# EAGLE design led_logger_v3 (EAGLE 6.5.0)
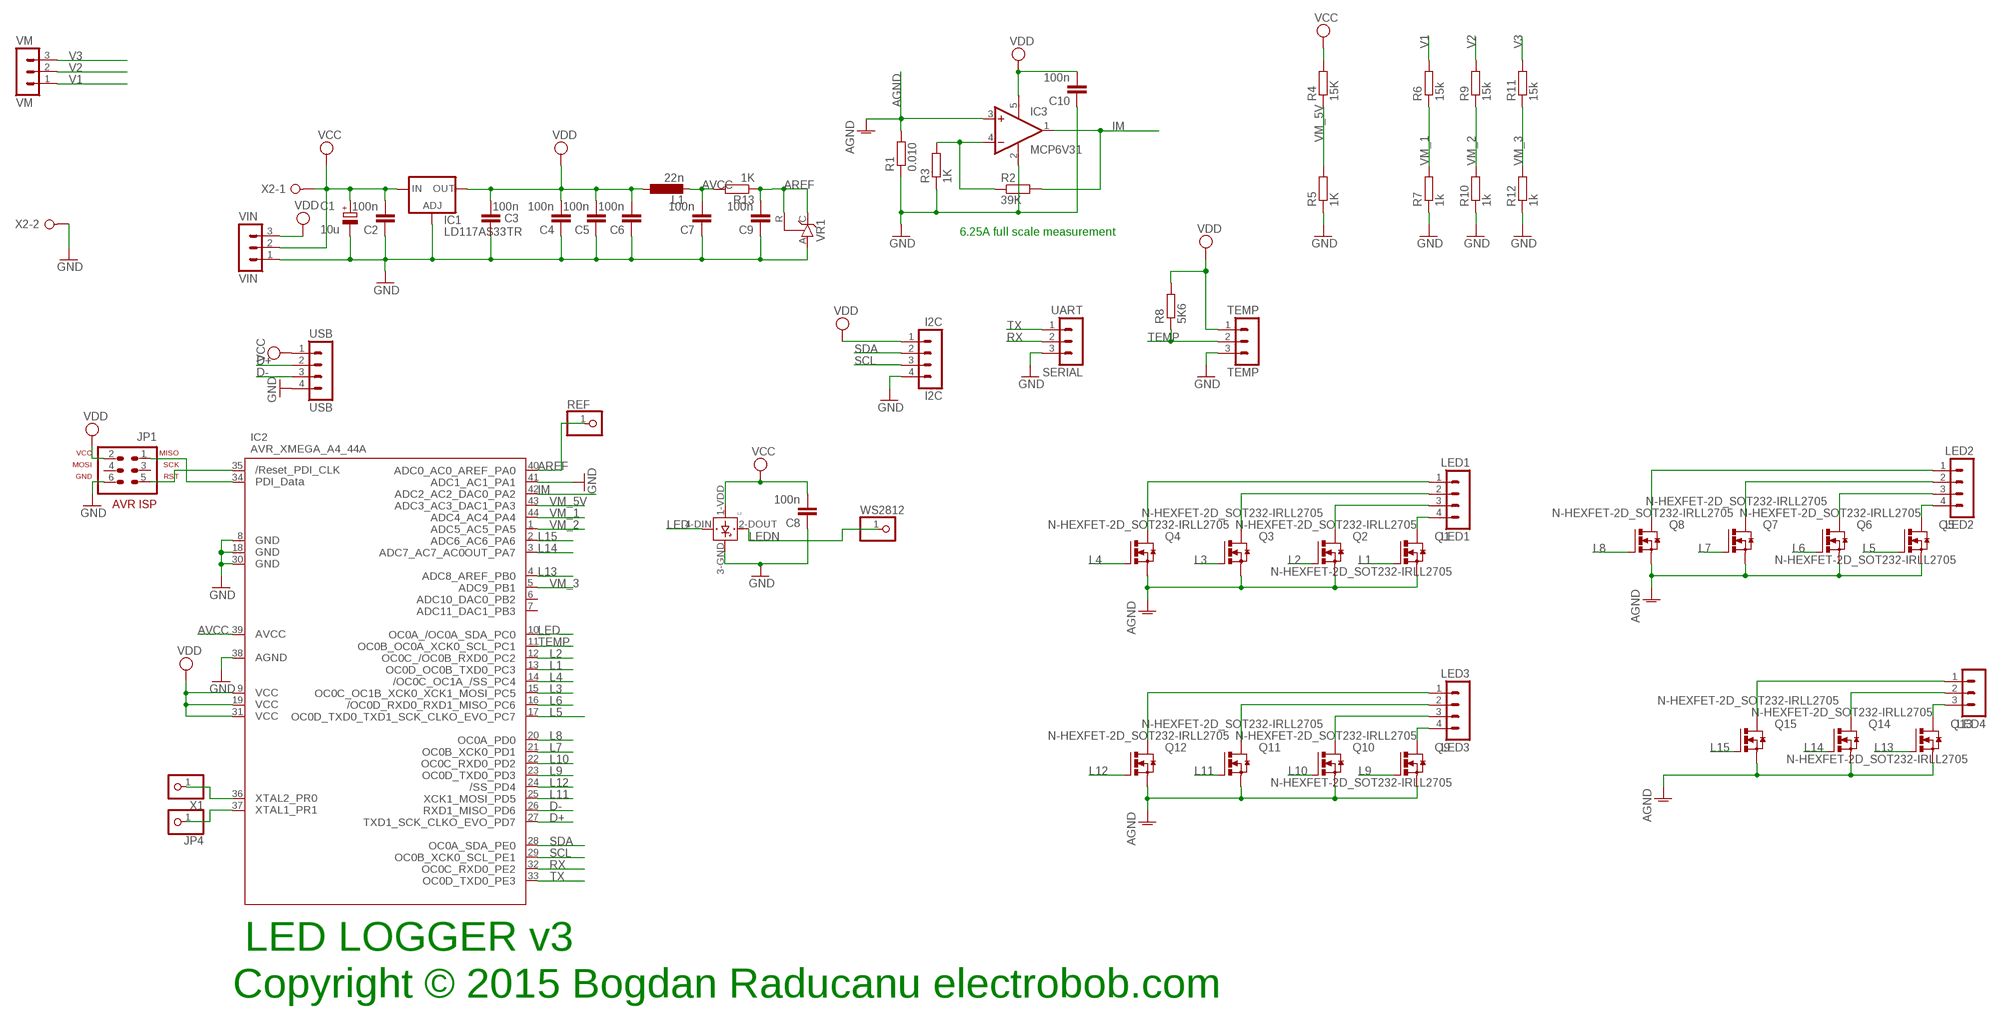
[diagram p0: schematic, sheet 1]

## Parts
C1  10u  CPOL-EUSMCA  [SMC_A]
C2  100n  C-EUC0805  [C0805]
C3  100n  C-EUC0805  [C0805]
C4  100n  C-EUC0805  [C0805]
C5  100n  C-EUC0805  [C0805]
C6  100n  C-EUC0805  [C0805]
C7  100n  C-EUC0805  [C0805]
C8  100n  C-EUC0805  [C0805]
C9  100n  C-EUC1206  [C1206]
C10  100n  C-EUC0805  [C0805]
I2C  I2C  MA04-1  [MA04-1]
IC1  LD117AS33TR  [SOT223]
IC2  AVR_XMEGA_A4_44A  [TQFP44]
IC3  MCP6V31  MCP601OT  [SOT23-5]
JP1  AVR-ISP-6VERT  [AVR-ISP-6]
JP4  PINHD-1X1  [1X01]
L1  22n  L-EUL2012C  [L2012C]
L2  WS2812B  [WS2812B]
LED1  LED1  MA04-1  [MA04-1]
LED2  LED2  MA04-1  [MA04-1]
LED3  LED3  MA04-1  [MA04-1]
LED4  MA03-1  [MA03-1]
Q1  N-HEXFET-2D_SOT232-IRLL2705  [SOT223]
Q2  N-HEXFET-2D_SOT232-IRLL2705  [SOT223]
Q3  N-HEXFET-2D_SOT232-IRLL2705  [SOT223]
Q4  N-HEXFET-2D_SOT232-IRLL2705  [SOT223]
Q5  N-HEXFET-2D_SOT232-IRLL2705  [SOT223]
Q6  N-HEXFET-2D_SOT232-IRLL2705  [SOT223]
Q7  N-HEXFET-2D_SOT232-IRLL2705  [SOT223]
Q8  N-HEXFET-2D_SOT232-IRLL2705  [SOT223]
Q9  N-HEXFET-2D_SOT232-IRLL2705  [SOT223]
Q10  N-HEXFET-2D_SOT232-IRLL2705  [SOT223]
Q11  N-HEXFET-2D_SOT232-IRLL2705  [SOT223]
Q12  N-HEXFET-2D_SOT232-IRLL2705  [SOT223]
Q13  N-HEXFET-2D_SOT232-IRLL2705  [SOT223]
Q14  N-HEXFET-2D_SOT232-IRLL2705  [SOT223]
Q15  N-HEXFET-2D_SOT232-IRLL2705  [SOT223]
R1  0.010  R-EU_0414/5V  [0414V]
R2  39K  R-EU_R0805  [R0805]
R3  1K  R-EU_R0805  [R0805]
R4  15K  R-EU_R0805  [R0805]
R5  1K  R-EU_R0805  [R0805]
R6  15k  R-EU_R0805  [R0805]
R7  1k  R-EU_R0805  [R0805]
R8  5K6  R-EU_R0805  [R0805]
R9  15k  R-EU_R0805  [R0805]
R10  1k  R-EU_R0805  [R0805]
R11  15k  R-EU_R0805  [R0805]
R12  1k  R-EU_R0805  [R0805]
R13  1K  R-EU_R0805  [R0805]
REF  PINHD-1X1  [1X01]
SERIAL  UART  MA03-1  [MA03-1]
TEMP  TEMP  MA03-1  [MA03-1]
USB  USB  MA04-1  [MA04-1]
VIN  VIN  MA03-1  [MA03-1]
VM  VM  MA03-1  [MA03-1]
VR1  TL431CLP  [TO92-CLP]
WS2812  PINHD-1X1  [1X01]
X1  PINHD-1X1  [1X01]
X2  W237-02P  [W237-132]

## Nets
AGND: IC3.3(+IN) Q1.3(S) Q2.3(S) Q3.3(S) Q4.3(S) Q5.3(S) Q6.3(S) Q7.3(S) Q8.3(S) Q9.3(S) Q10.3(S) Q11.3(S) Q12.3(S) Q13.3(S) Q14.3(S) Q15.3(S) R1.2
AREF: C9.2 IC2.40(PA0) R13.1 REF.1 VR1.C VR1.R
AVCC: C7.2 IC2.39(AVCC) L1.2 R13.2
D+: IC2.27(PD7) USB.2
D-: IC2.26(PD6) USB.3
GND: C1.- C2.1 C3.1 C4.1 C5.1 C6.1 C7.1 C8.1 C9.1 C10.1 I2C.4 IC1.1(ADJ) IC2.8(GND1) IC2.18(GND2) IC2.30(GND3) IC2.38(AGND) IC2.41(PA1) IC3.2(V-) JP1.6 L2.3-GND(GND) R1.1 R3.1 R5.1 R7.1 R10.1 R12.1 SERIAL.3 TEMP.3 USB.4 VIN.1 VR1.A X2.2
IM: IC2.42(PA2) IC3.1(OUT) R2.2
L1: IC2.13(PC3) Q1.1(G)
L2: IC2.12(PC2) Q2.1(G)
L3: IC2.15(PC5) Q3.1(G)
L4: IC2.14(PC4) Q4.1(G)
L5: IC2.17(PC7) Q5.1(G)
L6: IC2.16(PC6) Q6.1(G)
L7: IC2.21(PD1) Q7.1(G)
L8: IC2.20(PD0) Q8.1(G)
L9: IC2.23(PD3) Q9.1(G)
L10: IC2.22(PD2) Q10.1(G)
L11: IC2.25(PD5) Q11.1(G)
L12: IC2.24(PD4) Q12.1(G)
L13: IC2.4(PB0) Q13.1(G)
L14: IC2.3(PA7) Q14.1(G)
L15: IC2.2(PA6) Q15.1(G)
LED: IC2.10(PC0) L2.4-DIN(DIN)
LEDN: L2.2-DOUT(DOUT) WS2812.1
N$1: LED2.4 Q5.2(D) Q5.4(D)
N$2: LED3.3 Q10.2(D) Q10.4(D)
N$3: LED2.2 Q7.2(D) Q7.4(D)
N$4: LED2.1 Q8.2(D) Q8.4(D)
N$5: LED3.4 Q9.2(D) Q9.4(D)
N$6: LED1.4 Q1.2(D) Q1.4(D)
N$7: LED1.3 Q2.2(D) Q2.4(D)
N$8: LED1.2 Q3.2(D) Q3.4(D)
N$9: LED1.1 Q4.2(D) Q4.4(D)
N$10: LED2.3 Q6.2(D) Q6.4(D)
N$11: IC2.35(RESET) JP1.5
N$12: LED3.2 Q11.2(D) Q11.4(D)
N$13: LED3.1 Q12.2(D) Q12.4(D)
N$14: IC3.4(-IN) R2.1 R3.2
N$15: IC2.36(PR0) X1.1
N$17: IC2.37(PR1) JP4.1
N$18: LED4.3 Q13.2(D) Q13.4(D)
N$19: IC2.34(PDI_DATA) JP1.1
N$20: LED4.1 Q15.2(D) Q15.4(D)
N$22: LED4.2 Q14.2(D) Q14.4(D)
RX: IC2.32(PE2) SERIAL.2
SCL: I2C.3 IC2.29(PE1)
SDA: I2C.2 IC2.28(PE0)
TEMP: IC2.11(PC1) R8.1 TEMP.2
TX: IC2.33(PE3) SERIAL.1
V1: R6.2 VM.1
V2: R9.2 VM.2
V3: R11.2 VM.3
VCC: C1.+ C2.2 C8.2 IC1.3(IN) L2.1-VDD(VDD) R4.2 USB.1 VIN.2 X2.1
VDD: C3.2 C4.2 C5.2 C6.2 C10.2 I2C.1 IC1.4(OUT) IC2.9(VCC1) IC2.19(VCC2) IC2.31(VCC3) IC3.5(V+) JP1.2 L1.1 R8.2 TEMP.1 VIN.3
VM_1: IC2.44(PA4) R6.1 R7.2
VM_2: IC2.1(PA5) R9.1 R10.2
VM_3: IC2.5(PB1) R11.1 R12.2
VM_5V: IC2.43(PA3) R4.1 R5.2
Unconnected: IC2.6(PB2) IC2.7(PB3) JP1.3 JP1.4

## Notes on the sheet
- 6.25A full scale measurement
- LED LOGGER v3
- Copyright © 2015 Bogdan Raducanu electrobob.com

## Library data of the parts
C1 = rcl:CPOL-EU: POLARIZED CAPACITOR, European symbol
C2-C10 = rcl:C-EU: CAPACITOR, European symbol
I2C LED1-LED3 USB = con-lstb:MA04-1: PIN HEADER; OC_FARNELL: unknown; OC_NEWARK: unknown
IC1 = v-reg:LD117A?*: Low drop fixed and adjustable positive voltage regulators 1 A Source: http://www.st.com/stonline/products/literature/ds/7194/ld1117axx.pdf
IC2 = xmega:AVR_XMEGA_A4_: Device for Atmel AVR XMEGA A4 Series
IC3 = linear:MCP601: Single Op Amp 2.7V to 6.0V Single Supply CMOS Source: http://ww1.microchip.com/downloads/en/DeviceDoc/21314g.pdf
JP1 = avr-7:AVR-ISP-6: AVR ISP-6 Serial Programming Header
JP4 REF WS2812 X1 = pinhead:PINHD-1X1: PIN HEADER
L1 = resistor:L-EU: INDUCTOR, European symbol
L2 = adafruit:WS2812B
LED4 SERIAL TEMP VIN VM = con-lstb:MA03-1: PIN HEADER; OC_FARNELL: unknown; OC_NEWARK: unknown
Q1-Q15 = transistor-power:N-HEXFET-2D_?-*: HEXFET® Power MOSFET 2 Drain connects http://www.irf.com/product-info/datasheets/data/irll014n.pdf
R1-R13 = rcl:R-EU_: RESISTOR, European symbol
VR1 = v-reg:TL431CLP: VOLTAGE REGULATOR
X2 = con-wago-508:W237-02P: WAGO SREW CLAMP; OC_FARNELL: unknown; OC_NEWARK: unknown

## Board
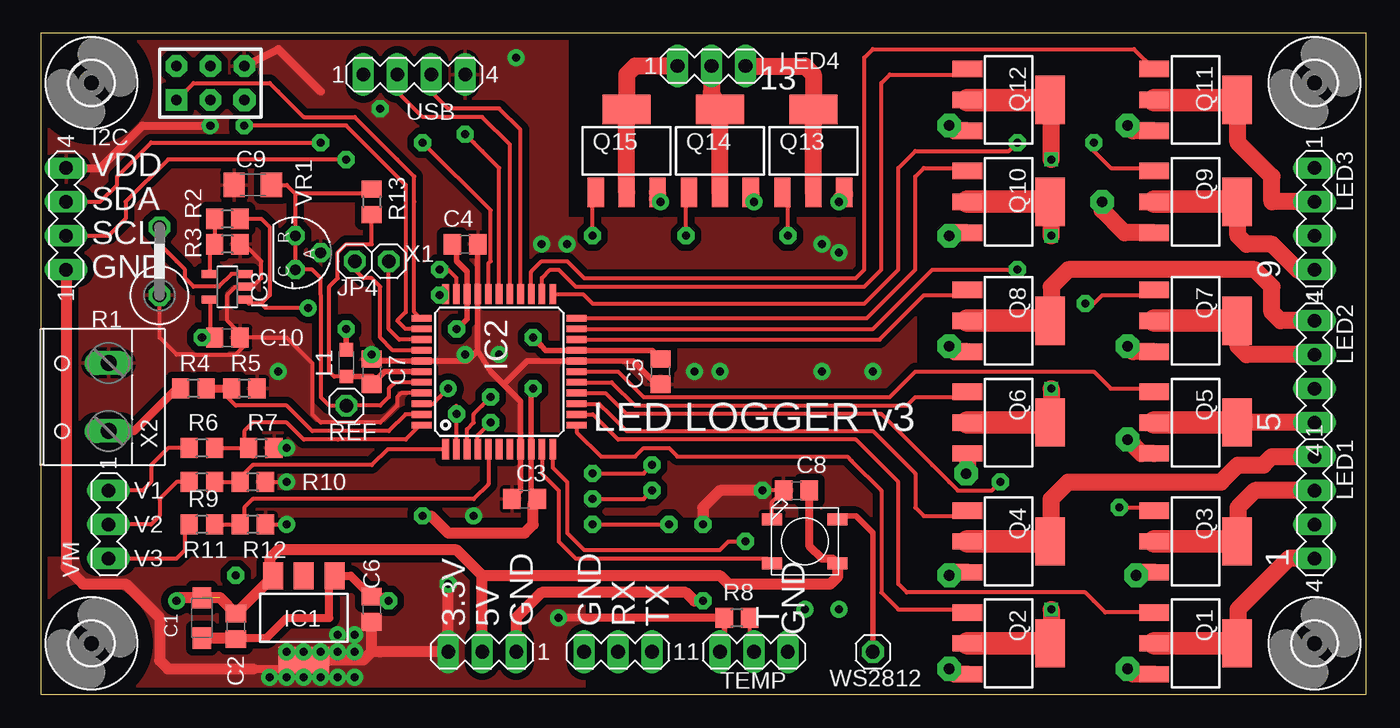
[diagram p1: board, top side]
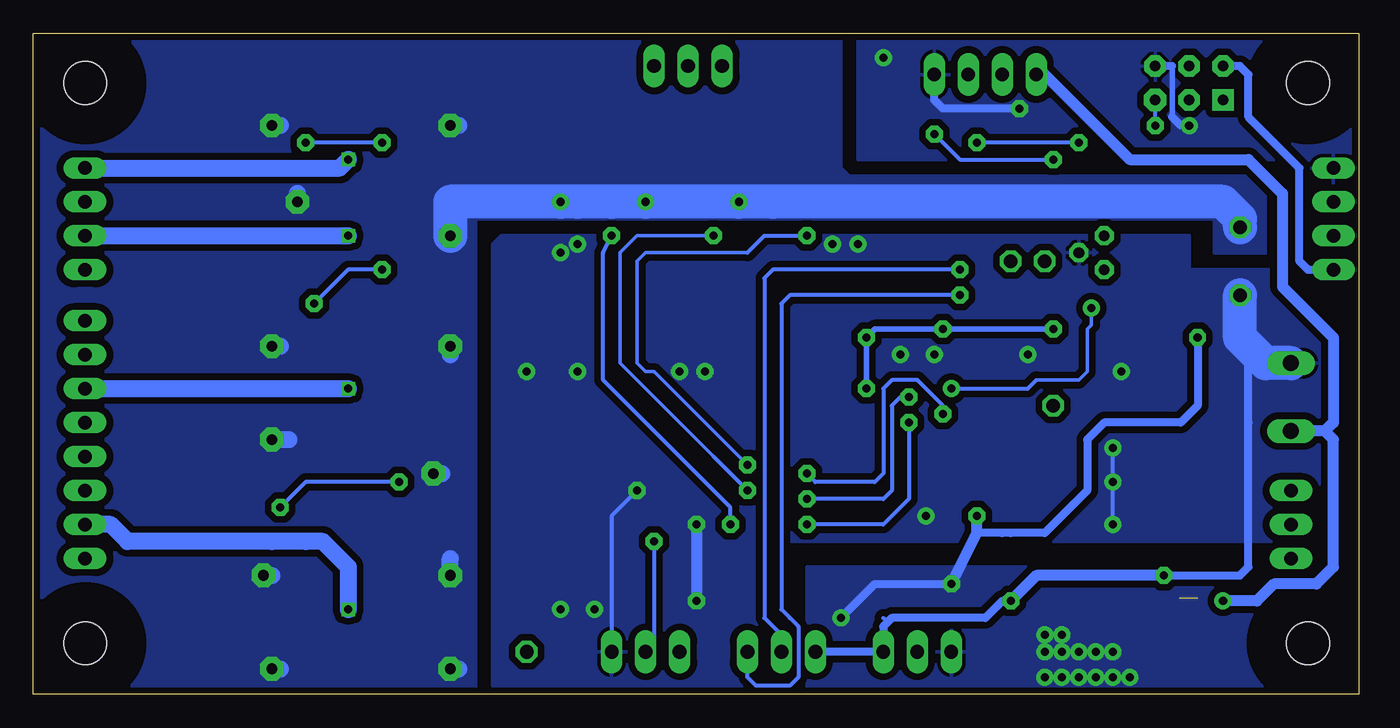
[diagram p2: board, bottom side, seen from below]

Size 99.11 x 49.42 mm. Coordinates in mm from the lower left corner, seen from the top.
Outline: 0,0 99.11,0 99.11,49.42 0,49.42 0,0
Copper layers (1*16): Top 0.035mm / dielectric 1.5mm / Bottom 0.035mm
Design rules "DFRobot_Eagle_Rule_v0.4": minimum track width 6mil, minimum drill 12mil, track to track 6mil, track to pad 6mil, pad to pad 6mil, via to via 6mil, smd to smd 0mil, copper to edge 10mil, drill to drill 10mil, minimum pad ring 12mil, minimum via ring 8mil, stop-mask expansion 2mil, vias tented up to drill 25mil, thermal gap 10mil

### Footprints (pad centres in the part's own frame; a part is rotated, then mirrored left to right if it is on the bottom)
SMC_A = smd 1.6 x 1.4: + -1.5,0; - 1.5,0
C0805 = smd 1.3 x 1.5: 1 -0.95,0; 2 0.95,0
C1206 = smd 1.6 x 1.8: 1 -1.4,0; 2 1.4,0
MA04-1 = drill 1.016 long: 1 -3.81,0; 2 -1.27,0; 3 1.27,0; 4 3.81,0
SOT223 = smd 1.5 x 2: 1 -2.3,-3.15; 2 0,-3.15; 3 2.3,-3.15 | smd 3.8 x 2: 4 0,3.15
TQFP44 = smd 1.5 x 0.5: 1 -5.8,4; 2 -5.8,3.2; 3 -5.8,2.4; 4 -5.8,1.6; 5 -5.8,0.8; 6 -5.8,0; 7 -5.8,-0.8; 8 -5.8,-1.6; 9 -5.8,-2.4; 10 -5.8,-3.2; 11 -5.8,-4; 23 5.8,-4; 24 5.8,-3.2; 25 5.8,-2.4; 26 5.8,-1.6; 27 5.8,-0.8; 28 5.8,0; 29 5.8,0.8; 30 5.8,1.6; 31 5.8,2.4; 32 5.8,3.2; 33 5.8,4 | smd 0.5 x 1.5: 12 -4,-5.8; 13 -3.2,-5.8; 14 -2.4,-5.8; 15 -1.6,-5.8; 16 -0.8,-5.8; 17 0,-5.8; 18 0.8,-5.8; 19 1.6,-5.8; 20 2.4,-5.8; 21 3.2,-5.8; 22 4,-5.8; 34 4,5.8; 35 3.2,5.8; 36 2.4,5.8; 37 1.6,5.8; 38 0.8,5.8; 39 0,5.8; 40 -0.8,5.8; 41 -1.6,5.8; 42 -2.4,5.8; 43 -3.2,5.8; 44 -4,5.8
SOT23-5 = smd 0.6 x 1.2: 1 -0.95,-1.306; 2 0,-1.306; 3 0.95,-1.306; 4 0.95,1.306; 5 -0.95,1.306
AVR-ISP-6 = drill 0.8 pad 1.6 square: 1 -2.54,-1.27 | drill 0.8 pad 1.6 octagon: 2 -2.54,1.27; 3 0,-1.27; 4 0,1.27; 6 2.54,1.27 | drill 0.8 pad 1.67 octagon: 5 2.54,-1.27
1X01 = drill 1.016 octagon: 1 0,0
L2012C = smd 1 x 1: 1 -1,0; 2 1,0
WS2812B = smd 1.5 x 0.9: 1-VDD 2.45,-1.65; 2-DOUT 2.45,1.65; 3-GND -2.45,1.65; 4-DIN -2.45,-1.65
MA03-1 = drill 1.016 long: 1 -2.54,0; 2 0,0; 3 2.54,0
SOT223' = smd 1.219 x 2.235: 1 -2.311,-3.099; 2 0,-3.099; 3 2.311,-3.099 | smd 3.6 x 2.2: 4 0,3.099
0414V = drill 1.016 octagon: 1 -2.54,0; 2 2.54,0
R0805 = smd 1.3 x 1.5: 1 -0.95,0; 2 0.95,0
3,2 = hole 3.2: 0,0
TO92-CLP = drill 0.813 octagon: A 0,1.905; C 1.27,0; R -1.27,0
W237-132 = drill 1.194 long: 1 -2.54,-0.635; 2 2.54,-0.635

### Placement (x,y rotation side)
C1  12.06,5.71 270 top
C2  14.61,5.08 90 top
C3  36.2,14.61 0 top
C4  31.75,33.66 180 top
C5  46.35,24.13 90 top
C6  24.77,6.35 270 top
C7  24.77,24.13 270 top
C8  56.52,15.24 0 top
C9  15.88,38.1 0 top
C10  13.97,26.67 180 top
I2C  1.91,35.56 90 top
IC1  19.68,5.71 180 top
IC2  34.29,24.13 90 top
IC3  13.97,30.48 90 top
JP1  12.7,45.72 0 top
JP4  23.5,32.38 0 top
L1  22.86,24.77 270 top
L2  57.15,11.43 0 top
LED1  95.25,13.97 270 top
LED2  95.25,24.13 270 top
LED3  95.25,35.56 270 top
LED4  50.16,46.99 0 top
Q1  N-HEXFET-2D_SOT232-IRLL2705  [SOT223']  86.36,3.81 270 top
Q2  N-HEXFET-2D_SOT232-IRLL2705  [SOT223']  72.39,3.81 270 top
Q3  N-HEXFET-2D_SOT232-IRLL2705  [SOT223']  86.36,11.43 270 top
Q4  N-HEXFET-2D_SOT232-IRLL2705  [SOT223']  72.39,11.43 270 top
Q5  N-HEXFET-2D_SOT232-IRLL2705  [SOT223']  86.36,20.32 270 top
Q6  N-HEXFET-2D_SOT232-IRLL2705  [SOT223']  72.39,20.32 270 top
Q7  N-HEXFET-2D_SOT232-IRLL2705  [SOT223']  86.36,27.94 270 top
Q8  N-HEXFET-2D_SOT232-IRLL2705  [SOT223']  72.39,27.94 270 top
Q9  N-HEXFET-2D_SOT232-IRLL2705  [SOT223']  86.36,36.83 270 top
Q10  N-HEXFET-2D_SOT232-IRLL2705  [SOT223']  72.39,36.83 270 top
Q11  N-HEXFET-2D_SOT232-IRLL2705  [SOT223']  86.36,44.45 270 top
Q12  N-HEXFET-2D_SOT232-IRLL2705  [SOT223']  72.39,44.45 270 top
Q13  N-HEXFET-2D_SOT232-IRLL2705  [SOT223']  57.78,40.64 0 top
Q14  N-HEXFET-2D_SOT232-IRLL2705  [SOT223']  50.8,40.64 0 top
Q15  N-HEXFET-2D_SOT232-IRLL2705  [SOT223']  43.81,40.64 0 top
R1  8.89,32.38 90 top
R2  13.97,35.56 0 top
R3  13.97,33.66 180 top
R4  11.43,22.86 180 top
R5  15.24,22.86 180 top
R6  12.06,18.41 180 top
R7  16.51,18.41 180 top
R8  52.07,5.71 180 top
R9  12.06,15.88 180 top
R10  15.88,15.88 180 top
R11  12.06,12.7 180 top
R12  15.88,12.7 180 top
R13  24.77,36.83 270 top
REF  22.86,21.59 0 top
SERIAL  43.18,3.17 180 top
TEMP  53.34,3.17 0 top
U$1  [3,2]  3.81,3.81 0 top
U$2  [3,2]  3.81,45.72 0 top
U$3  [3,2]  95.25,45.72 0 top
U$4  [3,2]  95.25,3.81 0 top
USB  27.94,46.35 0 top
VIN  33.02,3.17 180 top
VM  5.08,12.7 270 top
VR1  19.05,33.02 270 top
WS2812  62.23,3.17 0 top
X1  26.04,32.38 0 top
X2  4.45,22.23 90 top

### Tracks (layer width: path | path; a pad name or v marks a point on that pad's centre or on a via)
AGND  (via drill 0.6 pad 1.27, 0.8 pad 1.78)
  Top 0.305: IC3.3 14.29,31.43 13.34,30.48 11.43,30.48 10.79,31.11 10.79,31.75 10.16,32.38 9.53,33.02 8.89,33.66 R1.2
  Top 1.27: Q12.3 68.35,42.14 v67.94,42.55 | Q10.3 68.17,34.52 v67.94,34.29 | Q8.3 68.35,25.63 v67.94,26.04 | Q6.3 69.29,16.59 v69.22,16.51 | Q4.3 68.17,9.12 v67.94,8.89 | Q2.3 68.35,1.5 v67.94,1.91 | Q1.3 81.69,1.5 v81.28,1.91 | Q3.3 82.14,9.12 v81.92,8.89 | Q5.3 82.32,18.01 v81.28,19.05 | Q7.3 81.69,25.63 v81.28,26.04 | Q11.3 81.69,42.14 v81.28,42.55 | Q9.3 81.05,34.52 79.38,36.2 v79.38,36.83 | Q15.3 46.13,37.06 v46.35,36.83 | Q14.3 53.11,37.06 v53.34,36.83 | Q13.3 60.1,37.24 v59.69,36.83
  Bottom 1.27: v67.94,42.55 67.31,42.55 | v67.94,34.29 67.31,34.92 | v67.94,26.04 67.94,25.4 | v69.22,16.51 68.58,16.51 | v67.94,8.89 67.94,10.16 | v67.94,1.91 67.31,1.91 | v81.28,1.91 80.64,1.91 | v81.92,8.89 81.28,8.89 | v81.28,19.05 80.01,19.05 | v81.28,26.04 80.64,26.04 | v81.28,42.55 80.64,42.55 | v79.38,36.83 79.38,37.47 | v46.35,36.83 43.81,36.83 | v53.34,36.83 55.88,36.83 | v59.69,36.83 58.42,36.83
  Bottom 2.54: R1.2 8.89,35.56 10.16,36.83 43.81,36.83 v46.35,36.83 v53.34,36.83 55.88,36.83 58.42,36.83 v59.69,36.83 67.94,36.83 v67.94,34.29
  pour Bottom (isolate 0.5): 99.06,0 66.04,0 66.04,35.56 10.79,35.56 10.79,33.02 6.99,33.02 6.99,37.47 8.26,38.73 38.1,38.73 38.73,39.37 38.73,48.9 99.06,48.9
AREF
  Top 0.305: IC2.40 26.5,23.33 26.04,22.86 26.04,22.23 25.4,21.59 REF.1 21.59,21.59 20.95,22.23 20.95,29.84 20.95,31.11 20.32,31.75 VR1.C VR1.R 19.05,37.47 | R13.1 24.45,37.47 19.05,37.47 | C9.2 18.41,38.1 19.05,37.47
AVCC
  Top 0.305: L1.2 21.95,23.77 21.59,24.13 21.59,30.48 22.23,31.11 22.23,32.38 22.23,33.02 22.86,33.66 24.77,33.66 R13.2
  Top 0.406: IC2.39 25.71,24.13 C7.2 24.82,23.77 L1.2
D+
  Top 0.305: IC2.27 35.09,41.11 33.02,43.18 28.57,43.18 26.67,45.09 USB.2
D-
  Top 0.305: IC2.26 35.89,42.22 34.29,43.81 30.48,43.81 29.21,45.09 USB.3
GND  (via drill 0.6 pad 1.27)
  Top 0.305: R3.1 15.24,33.66 16.51,32.38 16.51,31.11 15.88,30.48 IC3.2 14.61,30.48 13.97,29.84 13.97,27.94 14.92,26.99 C10.1 | C10.1 15.24,26.35 15.24,26.04 14.61,25.4 11.43,25.4 10.16,25.4 8.89,26.67 R1.1 | IC2.41 26.98,22.53 26.67,22.23 26.67,21.59 25.4,20.32 20.95,20.32 20.32,20.95 20.32,24.77 18.41,26.67 16.51,26.67 C10.1 | L2.3-GND 54.7,14.38 C8.1 v53.98,15.24 | R12.1 v18.41,12.7 | R10.1 v18.41,15.88 | R7.1 v18.41,18.41
  Top 0.406: 34.61,23.18 35.89,21.89 IC2.8 35.89,15.25 C3.1 | 34.61,23.18 33.66,24.13 32.69,25.73 | 32.69,25.73 IC2.30 32.69,33.65 C4.1 | 32.69,25.73 31.89,24.93 IC2.38 25.55,24.93 | 34.61,23.18 36.36,24.93 IC2.18 44.28,24.93 45.72,23.5 46.04,23.5 C5.1
  Top 0.61: 14.52,4.21 16.91,4.21 18.41,5.71 21.59,5.71 21.59,8.47 IC1.1 23.2,8.87 C6.1 25.72,7.3 v26.04,6.99 | JP1.6 17.78,48.26 20.95,45.09 | I2C.4 4.45,39.37 7.62,42.55 v12.7,42.55
  Top 0.813: C1.- 14.52,4.21 C2.1 | v53.98,15.24 50.8,15.24 49.53,13.97 v49.53,12.7 | v49.53,6.99 48.9,6.99 48.26,7.62 37.47,7.62 35.56,5.71 VIN.1
  Bottom 0.305: v53.98,15.24 55.88,13.34 55.88,5.71 TEMP.3 | 35.56,5.71 35.24,5.4 | v18.41,12.7 v18.41,15.88 | v18.41,15.88 18.41,16.51 | 18.41,16.51 18.41,17.78 | 18.41,17.78 v18.41,18.41 18.41,17.78 | v18.41,15.88 18.41,16.51
  Bottom 0.406: 13.97,43.18 13.97,46.99
  Bottom 0.61: v14.61,8.89 8.89,8.89 8.26,9.53 8.26,20.32 8.26,24.13 8.26,26.04 | SERIAL.3 VIN.1 35.56,5.08 35.24,5.4 34.92,5.71 27.94,5.71 26.67,6.99 v26.04,6.99 | v25.4,43.81 31.11,43.81 31.75,44.45 USB.4 | v12.7,42.55 13.34,42.55 13.97,43.18 | 13.97,46.99 14.61,46.99 JP1.6
  Bottom 0.813: v49.53,12.7 v49.53,6.99 | v14.61,8.89 24.13,8.89 v26.04,6.99
  Bottom 2.54: X2.2 6.99,24.77 8.26,26.04 8.89,26.67 R1.1
  other vias: 37.47,33.66 39.37,33.66 58.42,24.13 62.23,24.13 57.15,6.35 59.69,6.35 58.42,33.66 59.69,33.02 48.9,24.13 50.8,24.13 24.77,25.4 34.29,25.4 31.75,25.4 17.78,24.13 35.56,47.62 32.38,13.34
  pour Top (isolate 0.5): -0.64,50.8 38.73,50.8 39.37,50.16 39.37,35.56 65.41,35.56 65.41,13.34 -0.64,13.34
  pour Bottom (isolate 0.5): -1.91,50.8 37.47,50.8 37.47,40.01 5.08,40.01 5.08,31.75 12.7,31.75 12.7,34.29 64.14,34.29 64.77,33.66 64.77,0.64 43.18,0.64 42.55,0 42.55,11.43 -1.91,11.43
IM  (via drill 0.6 pad 1.27)
  Top 0.305: v20,28.89 16.83,28.89 16.51,29.21 | 16.51,29.21 15.6,29.21 IC3.1 | R2.2 16.51,35.56 17.14,34.92 17.14,29.84 16.51,29.21 | IC2.42 29.35,21.73 29.84,22.23 v30.48,22.86
  Bottom 0.254: v20,28.89 20,27.62 20.32,27.3 20.32,24.13 20.95,23.5 24.13,23.5
  Bottom 0.305: v30.48,22.86 24.77,22.86 24.13,23.5
L1
  Top 0.305: Q1.1 79.6,6.12 78.74,6.99 78.11,7.62 64.77,7.62 64.14,8.26 64.14,15.88 60.96,19.05 43.18,19.05 42.55,19.68 41.91,20.32 41.3,20.93 IC2.13
L2
  Top 0.305: IC2.12 40.09,19.6 41.91,17.78 44.45,17.78 45.09,18.41 46.99,18.41 47.62,17.78 60.33,17.78 | 60.33,17.78 60.64,17.46 | 60.64,17.46 62.87,15.24 62.87,7.62 64.14,6.35 69.06,6.35 Q2.1 | 60.33,17.78 60.64,17.46
L3  (via drill 0.6 pad 1.27)
  Top 0.305: 82.78,13.74 Q3.1 83.03,13.97 v80.64,13.97 | IC2.15 42.24,22.53 43.18,21.59 43.81,20.95 62.87,20.95 66.67,17.14 67.94,15.88 68.58,15.24 71.12,15.24 v71.75,15.88
  Bottom 0.305: v71.75,15.88 78.74,15.88 v80.64,13.97
L4
  Top 0.305: IC2.14 41.77,21.73 42.55,20.95 43.18,20.32 43.81,19.68 62.23,19.68 65.41,16.51 65.41,13.97 66.04,13.34 68.89,13.34 Q4.1
L5
  Top 0.305: IC2.17 43.18,24.13 45.09,22.23 63.5,22.23 65.41,24.13 78.74,24.13 80.01,22.86 83.03,22.86 Q5.1
L6
  Top 0.305: IC2.16 42.71,23.33 44.45,21.59 64.77,21.59 65.41,22.23 68.89,22.23 Q6.1
L7  (via drill 0.6 pad 1.27)
  Top 0.305: IC2.21 62.26,27.33 66.67,31.75 v73.03,31.75 | v78.11,29.21 78.74,29.21 79.38,29.84 82.86,29.84 Q7.1
  Bottom 0.305: v73.03,31.75 75.56,31.75 v78.11,29.21
L8
  Top 0.305: IC2.20 62.73,26.53 66.04,29.84 67.31,29.84 68.89,29.84 Q8.1
L9  (via drill 0.6 pad 1.27)
  Top 0.305: IC2.23 40.55,29.93 41.27,29.21 61.59,29.21 62.23,29.84 64.14,31.75 64.14,39.37 65.41,40.64 72.39,40.64 v73.03,41.27 | v78.74,41.27 78.74,40.64 80.01,39.37 83.03,39.37 Q9.1
  Bottom 0.305: v73.03,41.27 v78.74,41.27
L10
  Top 0.305: IC2.22 61.78,28.13 65.41,31.75 65.41,33.02 65.41,38.73 66.04,39.37 69.06,39.37 Q10.1
L11
  Top 0.305: IC2.25 36.69,31.61 37.47,32.38 39.37,32.38 40.64,31.11 60.96,31.11 61.59,31.75 61.59,47.62 62.23,48.26 81.76,48.26 Q11.1
L12
  Top 0.305: IC2.24 37.49,31.14 38.1,31.75 38.73,31.75 40.01,30.48 61.59,30.48 62.87,31.75 62.87,45.72 63.5,46.35 69.22,46.35 69.85,46.99 69.52,46.99 Q12.1
L13  (via drill 0.6 pad 1.27)
  Top 0.305: IC2.4 32.69,19.36 v33.66,20.32 | v41.27,12.7 v46.99,12.7 | v55.88,34.29 55.88,37.77 Q13.1
  Bottom 0.305: v33.66,20.32 33.66,14.61 35.56,12.7 v41.27,12.7 | v46.99,12.7 46.99,13.97 49.53,16.51 56.52,23.5 56.52,33.02 v55.88,34.29
L14  (via drill 0.6 pad 1.27)
  Top 0.305: v41.27,14.61 45.09,14.61 v45.72,15.24 | v48.26,34.29 48.26,37.47 48.26,37.95 Q14.1 | IC2.3 31.89,19.82 32.38,20.32 32.38,20.95 33.02,21.59 v33.66,22.23
  Bottom 0.254: 48.26,17.78 55.24,24.77 55.24,33.02 53.98,34.29 v48.26,34.29
  Bottom 0.305: v33.66,22.23 34.29,22.23 34.92,21.59 34.92,15.24 35.56,14.61 v41.27,14.61 | v45.72,15.24 48.26,17.78
L15  (via drill 0.6 pad 1.27)
  Top 0.305: IC2.2 31.09,21.57 v31.11,20.95 | v41.27,16.51 45.09,16.51 v45.72,17.14 | v41.27,34.29 41.27,37.95 Q15.1
  Bottom 0.254: 45.72,33.02 53.34,33.02 53.98,32.38 53.98,24.77 53.34,24.13 52.7,24.13 v45.72,17.14
  Bottom 0.305: v31.11,20.95 31.11,21.59 33.02,23.5 34.92,23.5 35.56,22.86 35.56,16.51 36.2,15.88 40.64,15.88 v41.27,16.51 | 45.72,33.02 44.45,34.29 v41.27,34.29
LED
  Top 0.305: IC2.10 37.49,16.54 37.47,16.51 38.73,15.24 38.73,12.06 38.73,11.43 40.01,10.16 54.32,10.16 L2.4-DIN 54.45,9.53
LEDN
  Top 0.406: L2.2-DOUT 59.85,13.34 60.96,13.34 62.23,12.06 WS2812.1
N$1
  Top 1.27: LED2.4 Q5.4
  Top 1.676: Q5.2 Q5.4
N$2  (via drill 0.6)
  Top 1.27: v75.56,34.29 75.56,36.75 Q10.4
  Top 1.676: Q10.2 Q10.4
  Bottom 1.27: LED3.3 v75.56,34.29
N$3
  Top 1.27: LED2.2 90.17,25.4 89.53,26.04 89.53,27.86 Q7.4
  Top 1.676: Q7.2 Q7.4
N$4
  Top 1.27: LED2.1 92.71,27.94 92.08,28.57 92.08,30.48 90.81,31.75 76.83,31.75 75.56,30.48 75.56,28.02 Q8.4
  Top 1.676: Q8.4 Q8.2
N$5
  Top 1.27: LED3.4 93.98,31.75 92.08,33.66 90.17,33.66 89.53,34.29 89.53,36.75 Q9.4
  Top 1.676: Q9.2 Q9.4
N$6
  Top 1.27: LED1.4 93.34,10.16 89.53,6.35 89.53,3.89 Q1.4
  Top 1.676: Q1.2 Q1.4
N$7  (via drill 0.6)
  Top 1.27: v75.56,6.35 75.56,3.73 Q2.4
  Top 1.676: Q2.2 Q2.4
  Bottom 1.27: v75.56,6.35 75.56,9.53 77.47,11.43 78.74,11.43 81.28,11.43 92.08,11.43 93.34,12.7 LED1.3
N$8
  Top 1.27: LED1.2 90.81,15.24 89.53,13.97 89.53,11.51 Q3.4
  Top 1.676: Q3.2 Q3.4
N$9
  Top 1.27: Q4.4 75.56,11.51 75.56,14.61 76.83,15.88 88.27,15.88 89.53,17.14 91.44,17.14 92.08,17.78 LED1.1
  Top 1.676: Q4.2 Q4.4
N$10  (via drill 0.6)
  Top 1.27: v75.56,22.86 75.56,20.4 Q6.4
  Top 1.676: Q6.2 Q6.4
  Bottom 1.27: LED2.3 v75.56,22.86
N$11  (via drill 0.6 pad 1.27)
  Top 0.305: IC2.35 27.28,27.33 26.67,27.94 27.3,28.57 27.3,38.1 22.86,42.55 v15.24,42.55
  Bottom 0.305: v15.24,42.55 JP1.5
N$12
  Top 1.27: LED3.2 92.08,36.83 92.08,38.73 89.53,41.27 89.53,44.37 Q11.4
  Top 1.676: Q11.2 Q11.4
N$13  (via drill 0.6)
  Top 1.27: v75.56,40.01 75.56,44.37 Q12.4
  Top 1.676: Q12.2 Q12.4
  Bottom 1.27: LED3.1 76.2,39.37 v75.56,40.01
N$14
  Top 0.305: IC3.4 12.66,33.3 R3.2 R2.1
N$15
  Top 0.305: X1.1 26.04,31.75 26.04,27.3 26.81,26.53 IC2.36
N$17
  Top 0.305: IC2.37 26.34,25.73 25.4,26.67 25.4,30.48 24.77,31.11 24.13,31.11 23.5,31.75 JP4.1
N$18
  Top 1.27: LED4.3 57.15,46.99 57.78,46.35 Q13.4 Q13.2
N$19
  Top 0.305: IC2.34 28.39,28.13 27.94,28.57 27.94,36.83 27.94,38.73 26.67,40.01 23.5,43.18 19.68,43.18 17.78,45.09 17.14,45.72 11.43,45.72 JP1.1
N$20
  Top 1.27: LED4.1 44.45,46.99 43.81,46.35 Q15.4 Q15.2
N$22
  Top 1.27: LED4.2 50.16,45.01 Q14.4 Q14.2
RX  (via drill 0.6 pad 1.27)
  Top 0.305: IC2.32 31.09,31.14 30.48,31.75 v29.84,31.75
  Bottom 0.305: SERIAL.2 43.18,4.45 44.45,5.71 44.45,31.11 43.81,31.75 v29.84,31.75
SCL  (via drill 0.6 pad 1.27)
  Top 0.305: v20.95,41.27 8.26,41.27 5.71,38.73 5.71,38.1 4.45,36.83 I2C.3 | v28.57,41.27 33.66,36.2 33.66,32.38 33.49,32.22 IC2.29
  Bottom 0.305: v20.95,41.27 v28.57,41.27
SDA  (via drill 0.6 pad 1.27)
  Top 0.305: IC2.28 34.29,39.37 33.02,40.64 32.38,41.27 v31.75,41.91 | v22.86,40.01 9.53,40.01 6.35,36.83 6.35,35.56 5.08,34.29 I2C.2
  Bottom 0.305: v31.75,41.91 29.84,40.01 v22.86,40.01
TEMP  (via drill 0.6 pad 1.27)
  Top 0.305: R8.1 53.02,3.5 TEMP.2 | IC2.11 38.29,16.95 39.37,15.88 39.37,12.06 40.64,10.79 50.8,10.79 51.44,11.43 v52.7,11.43
  Bottom 0.305: v52.7,11.43 52.7,3.17 TEMP.2
TX  (via drill 0.6 pad 1.27)
  Top 0.305: IC2.33 29.93,29.93 v29.84,29.84
  Bottom 0.305: v29.84,29.84 42.55,29.84 43.18,29.21 43.18,6.35 42.55,5.71 41.91,5.08 41.91,1.27 42.55,0.64 45.09,0.64 45.72,1.27 SERIAL.1
V1
  Top 0.305: R6.2 9.53,18.41 8.26,17.14 8.26,15.88 7.62,15.24 VM.1
V2
  Top 0.305: R9.2 10.16,15.88 8.89,14.61 8.89,13.34 8.26,12.7 VM.2
V3
  Top 0.305: VM.3 10.16,10.16 10.79,10.79 10.79,12.38 R11.2
VCC  (via drill 0.6 pad 1.27)  (1 unrouted)
  Top 0.61: C8.2 57.47,11.12 58.42,10.16 59.22,10.16 L2.1-VDD | R4.2 10.16,22.86 6.99,19.68 X2.1
  Top 0.813: VIN.2 33.02,8.89 | 33.02,8.89 31.11,10.79 17.78,10.79 17.14,10.16 17.14,9.11 IC1.3 17.39,8.81 C2.2 13.42,7.21 10.39,7.21 v10.16,6.99 | 33.02,8.89 50.8,8.89 51.44,8.26 59.05,8.26 59.6,8.8 L2.1-VDD
  Bottom 0.813: USB.1 24.13,46.99 20.32,43.18 17.14,40.01 8.26,40.01 5.71,37.47 5.71,30.48 1.91,26.67 1.91,23.5 1.91,22.86 1.91,20.32 2.54,19.68 | 2.54,19.68 X2.1 | 2.54,19.68 1.91,19.05 1.91,9.53 3.17,8.26 6.35,8.26 7.62,6.99 v10.16,6.99
VDD  (via drill 0.6 pad 1.27)
  Top 0.305: IC3.5 12.66,27.03 C10.2
  Top 0.406: C4.2 31.11,33.34 31.11,32.38 31.89,31.61 IC2.31 31.89,28.08 v31.11,27.3 | C3.2 36.69,15.06 IC2.9 36.69,22.72 v36.83,22.86 | v36.83,26.67 37.47,26.04 37.77,25.73 IC2.19 45.7,25.73 C5.2 | L1.1 22.86,26.67 v22.86,27.3 | R8.2 51.12,3.5 TEMP.1
  Top 0.61: 15.88,1.91 19.02,1.91 IC1.4 | C10.2 v12.06,26.67 | R8.2 v38.73,5.71
  Top 0.813: IC1.4 24.16,2.56 24.77,3.17 | 24.77,3.17 C6.2 | 24.77,3.17 25.4,3.17 VIN.3 v30.48,8.26 | v28.57,13.34 29.21,13.34 30.48,12.06 36.2,12.06 36.83,12.7 36.83,14.29 C3.2 | 15.88,1.91 9.53,1.91 8.89,2.54 8.89,5.71 6.35,8.26 3.17,8.26 1.91,9.53 I2C.1
  Bottom 0.406: v36.83,22.86 v36.83,26.67 36.2,27.3 v31.11,27.3 v22.86,27.3
  Bottom 0.61: JP1.2 8.89,46.99 8.26,46.35 8.26,43.18 6.99,41.91 6.35,41.27 4.45,39.37 4.45,32.38 3.81,31.75 I2C.1 | 26.04,12.06 26.67,12.06 | 26.67,12.06 28.57,12.06 | 26.67,12.06 23.5,12.06 20.95,14.61 20.32,15.24 20.32,19.05 19.05,20.32 13.34,20.32 12.06,21.59 v12.06,26.67 | v38.73,5.71 36.2,8.26 v30.48,8.26
  Bottom 0.813: v30.48,8.26 28.57,12.06 v28.57,13.34
  other vias: 19.68,3.17 22.23,3.17 22.23,1.27 19.68,1.27 20.95,1.27 20.95,3.17 18.41,3.17 18.41,1.27 22.23,4.45 23.5,4.45 23.5,3.17 23.5,1.27 17.14,1.27
  pour Top (isolate 0.5, no thermals): 0,10.16 38.73,10.16 40.64,8.26 40.64,0 0,0
  pour Bottom (isolate 0.5): 0,9.53 41.27,9.53 41.27,0 0,0
VM_1
  Top 0.305: R6.1 R7.2 | IC2.44 28.39,20.13 27.3,19.05 22.23,19.05 19.68,19.05 18.41,20.32 15.88,20.32 15.24,19.68 15.24,18.73 R7.2 | 15.88,17.78 15.88,18.1 R7.2
VM_2
  Top 0.305: R9.1 R10.2 15.24,16.19 15.24,16.51 15.88,17.14 24.77,17.14 25.95,18.33 IC2.1
VM_3
  Top 0.305: R11.1 R12.2 | R12.2 14.93,12.38 | IC2.5 33.49,15.71 32.38,14.61 15.88,14.61 15.24,13.97 15.24,13.02 R12.2
VM_5V
  Top 0.305: IC2.43 27.28,20.93 26.04,19.68 20.32,19.68 18.41,21.59 14.61,21.59 13.97,22.23 13.97,22.54 R5.2
  Top 0.61: R4.1 R5.2

### Text on the board
tNames: 13 | VDD | SDA | SCL | GND | 9 | LED LOGGER v3 | 5 | V1 | V2 | V3 | 1 | 3.3V | 5V | GND | GND | RX | TX | T | GND
tDocu: electrobob.com | 09.2014